# Altium schematic sheet Controller.SchDoc
size Legal
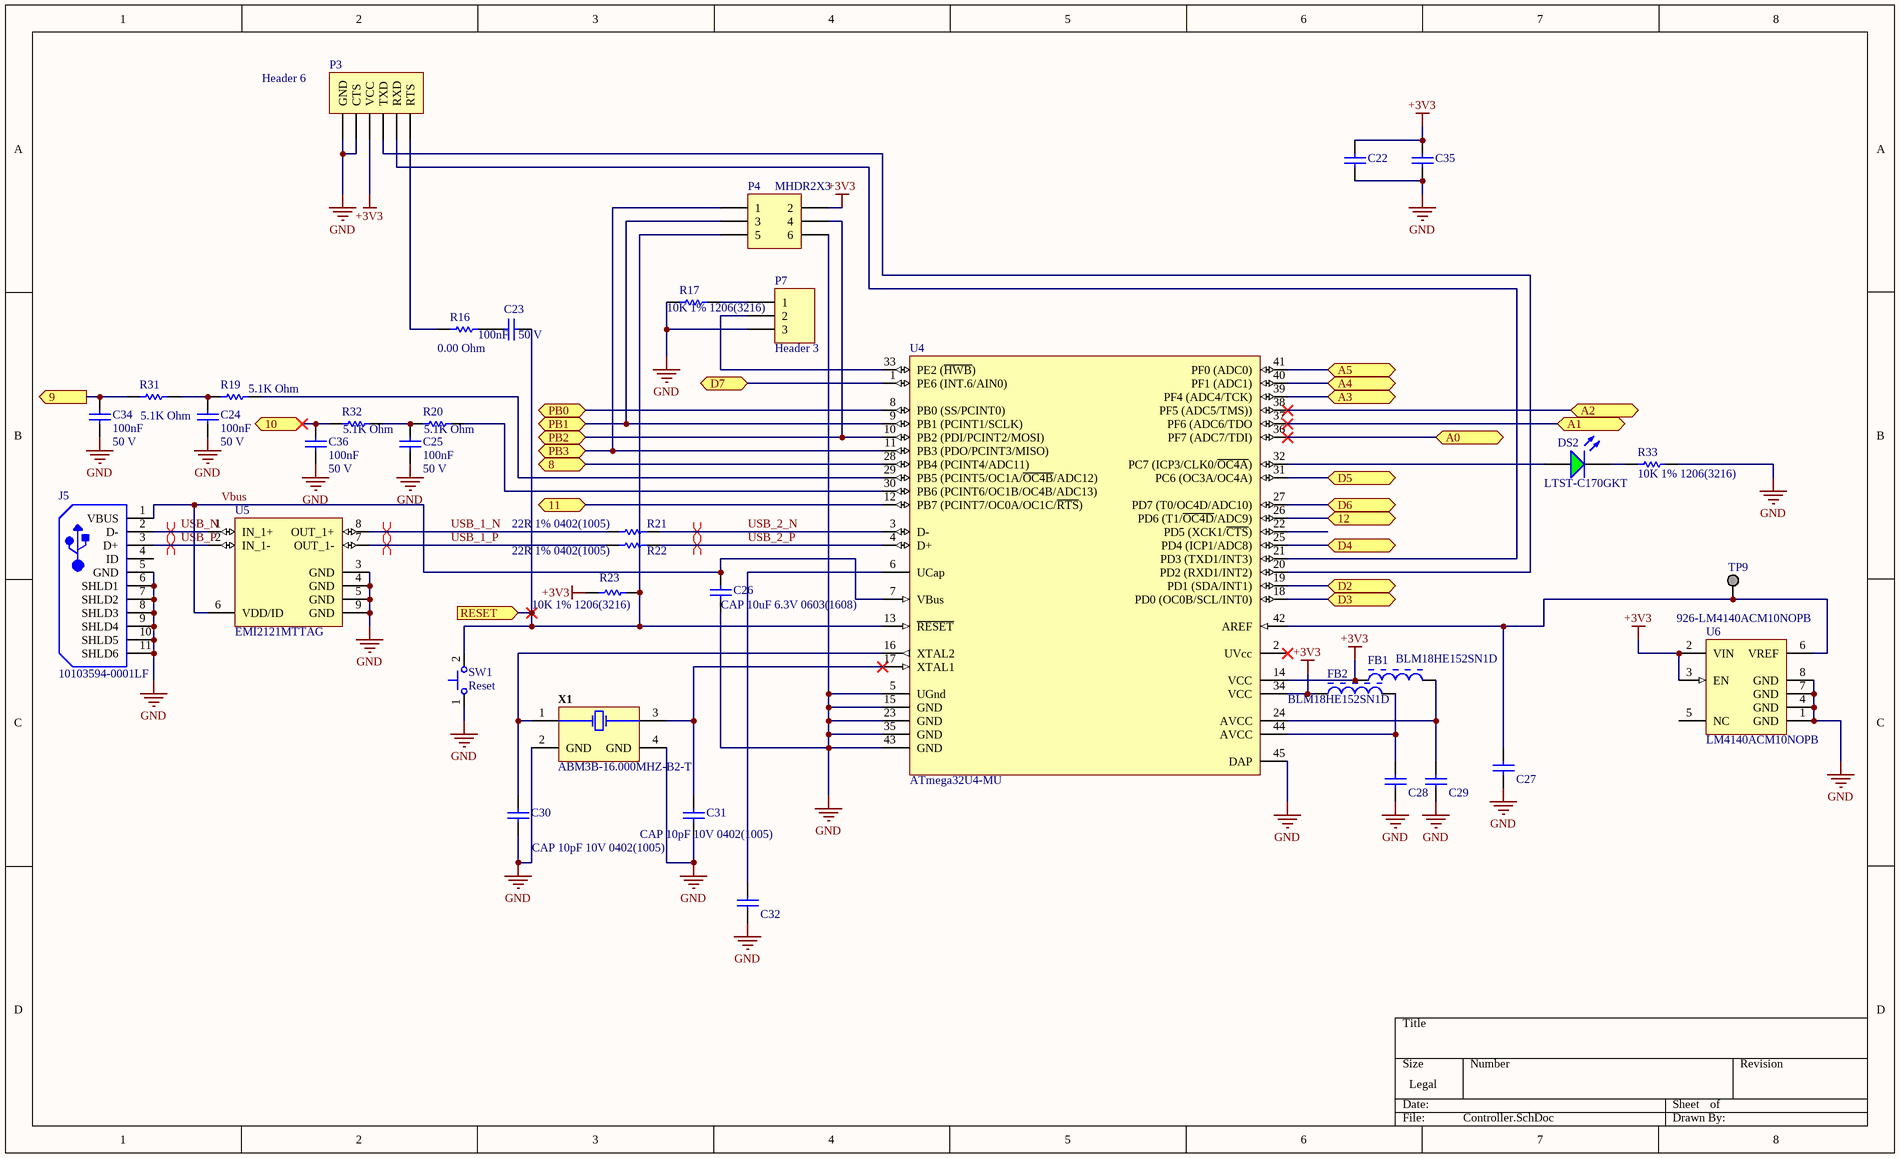
[diagram p0: Controller.SchDoc]

## Parts
C22  CAP 10uF 6.3V 0603(1608)  [CAPC0603(1608)100_L]  (value not drawn)
C23  value 100nF  Rated Voltage: 50 V  [CAPC1206(3216)100_N]  (hidden comment: CAP 100nF 50V 1206(3216))
C24  value 100nF  Rated Voltage: 50 V  [CAPC1206(3216)100_N]  (hidden comment: CAP 100nF 50V 1206(3216))
C25  value 100nF  Rated Voltage: 50 V  [CAPC1206(3216)100_N]  (hidden comment: CAP 100nF 50V 1206(3216))
C26  CAP 10uF 6.3V 0603(1608)  [CAPC0603(1608)100_L]
C27  CAP 1uF 25V 1206(3216)  [CAPC1206(3216)190_L]  (value not drawn)
C28  CAP 1uF 25V 1206(3216)  [CAPC1206(3216)190_L]  (value not drawn)
C29  CAP 1uF 25V 1206(3216)  [CAPC1206(3216)190_L]  (value not drawn)
C30  CAP 10pF 10V 0402(1005)  [CAPC0402(1005)60_L]
C31  CAP 10pF 10V 0402(1005)  [CAPC0402(1005)60_L]
C32  CAP 1uF 25V 1206(3216)  [CAPC1206(3216)190_L]  (value not drawn)
C34  value 100nF  Rated Voltage: 50 V  [CAPC1206(3216)100_N]  (hidden comment: CAP 100nF 50V 1206(3216))
C35  CAP 10uF 6.3V 0603(1608)  [CAPC0603(1608)100_L]  (value not drawn)
C36  value 100nF  Rated Voltage: 50 V  [CAPC1206(3216)100_N]  (hidden comment: CAP 100nF 50V 1206(3216))
DS2  LTST-C170GKT  [LTST-C170GKT_V]
FB1  BLM18HE152SN1D  [MURA-BLM18-RF-H4-CHIP-2_V]
FB2  BLM18HE152SN1D  [MURA-BLM18-RF-H4-CHIP-2_V]
J5  10103594-0001LF  [FCI-10103594-0001LF_V]
P3  Header 6  [HDR1X6]
P4  MHDR2X3  [MHDR2X3]
P7  Header 3  [HDR1X3]
R16  value 0.00 Ohm  [RESC1206(3216)_L]  (hidden comment: Jumper 1206(3216))
R17  10K 1% 1206(3216)  [RESC1206(3216)_L]
R19  value 5.1K Ohm  [RESC1206(3216)_L]  (hidden comment: 5K1 1% 1206(3216))
R20  value 5.1K Ohm  [RESC1206(3216)_L]  (hidden comment: 5K1 1% 1206(3216))
R21  22R 1% 0402(1005)  [RESC0402(1005)_L]
R22  22R 1% 0402(1005)  [RESC0402(1005)_L]
R23  10K 1% 1206(3216)  [RESC1206(3216)_L]
R31  value 5.1K Ohm  [RESC1206(3216)_L]  (hidden comment: 5K1 1% 1206(3216))
R32  value 5.1K Ohm  [RESC1206(3216)_L]  (hidden comment: 5K1 1% 1206(3216))
R33  10K 1% 1206(3216)  [RESC1206(3216)_L]
SW1  Reset  [JNFU-TVAF06_V]
TP9  ARef  [KSTN-1502-2]  (value not drawn)
U4  ATmega32U4-MU  [44PW_M]
U5  EMI2121MTTAG  [ONSC-WDFN-8-511BN_V]
U6  LM4140ACM10NOPB  Supplier Part Number 1: 926-LM4140ACM10NOPB  [D0008A_N]
X1  ABM3B-16.000MHZ-B2-T  [ABRA-ABM3B_V]

## Ports
8 (bidir), 9 (out), 10 (bidir), 11 (bidir), 12 (bidir), A0 (bidir), A1 (bidir), A2 (bidir), A3 (bidir), A4 (bidir), A5 (bidir), D2 (bidir), D3 (bidir), D4 (bidir), D5 (bidir), D6 (bidir), D7 (bidir), PB0 (bidir), PB1 (bidir), PB2 (bidir), PB3 (bidir), RESET (in)

## Nets
+3V3: C22.2 C35.2 FB1.1 FB2.1 P3.3(VCC) P4.2 R23.2 U4.14(VCC) U4.34(VCC) U6.2(VIN) U6.3(EN)
GND: C22.1 C24.2 C25.2 C26.1 C27.1 C28.1 C29.1 C30.1 C31.1 C32.1 C34.2 C35.1 C36.2 J5.5(GND) J5.6(SHLD1) J5.7(SHLD2) J5.8(SHLD3) J5.9(SHLD4) J5.10(SHLD5) J5.11(SHLD6) P3.1(GND) P3.2(CTS) P4.6 P7.3 R17.1 R33.2 SW1.1 U4.5(UGnd) U4.15(GND) U4.23(GND) U4.35(GND) U4.43(GND) U4.45(DAP) U5.3(GND) U5.4(GND) U5.5(GND) U5.9(GND) U6.1(GND) U6.4(GND) U6.7(GND) U6.8(GND) X1.2(GND) X1.4(GND)
8: U4.28(PB4_(PCINT4/ADC11)) ; port 8
9: C34.1 R31.1 ; port 9
10: C36.1 R32.1 ; port 10
11: U4.12(PB7_(PCINT7/OC0A/OC1C/~{RTS})) ; port 11
12: U4.26(PD6_(T1/~{OC4D}/ADC9)) ; port 12
A0: U4.36(PF7_(ADC7/TDI)) ; port A0
A1: U4.37(PF6_(ADC6/TDO) ; port A1
A2: U4.38(PF5_(ADC5/TMS))) ; port A2
A3: U4.39(PF4_(ADC4/TCK)) ; port A3
A4: U4.40(PF1_(ADC1)) ; port A4
A5: U4.41(PF0_(ADC0)) ; port A5
D2: U4.19(PD1_(SDA/INT1)) ; port D2
D3: U4.18(PD0_(OC0B/SCL/INT0)) ; port D3
D4: U4.25(PD4_(ICP1/ADC8)) ; port D4
D5: U4.31(PC6_(OC3A/OC4A)) ; port D5
D6: U4.27(PD7_(T0/OC4D/ADC10)) ; port D6
D7: U4.1(PE6_(INT.6/AIN0)) ; port D7
PB0: U4.8(PB0_(SS/PCINT0)) ; port PB0
PB1: P4.3 U4.9(PB1_(PCINT1/SCLK)) ; port PB1
PB2: P4.4 U4.10(PB2_(PDI/PCINT2/MOSI)) ; port PB2
PB3: P4.1 U4.11(PB3_(PDO/PCINT3/MISO)) ; port PB3
RESET: C23.2 P4.5 R23.1 SW1.2 U4.13(~{RESET}) ; port RESET
USB_1_N: R21.1 U5.8(OUT_1+)
USB_1_P: R22.1 U5.7(OUT_1-)
USB_2_N: R21.2 U4.3(D-)
USB_2_P: R22.2 U4.4(D+)
USB_N: J5.2(D-) U5.1(IN_1+)
USB_P: J5.3(D+) U5.2(IN_1-)
Vbus: C26.2 J5.1(VBUS) U4.7(VBus) U5.6(VDD/ID)
NetC23_1: C23.1 R16.2
NetC24_1: C24.1 R19.1 R31.2
NetC25_1: C25.1 R20.1 R32.2
NetC27_2: C27.2 TP9.1 U4.42(AREF) U6.6(VREF)
NetC28_2: C28.2 FB2.2 U4.44(AVCC)
NetC29_2: C29.2 FB1.2 U4.24(AVCC)
NetC30_2: C30.2 U4.16(XTAL2) X1.1(X1)
NetC31_2: C31.2 U4.17(XTAL1) X1.3(X2)
NetC32_2: C32.2 U4.6(UCap)
NetDS2_1: DS2.1(A) U4.32(PC7_(ICP3/CLK0/~{OC4A}))
NetDS2_2: DS2.2(K) R33.1
NetP3_4: P3.4(TXD) U4.20(PD2_(RXD1/INT2))
NetP3_5: P3.5(RXD) U4.21(PD3_(TXD1/INT3))
NetP3_6: P3.6(RTS) R16.1
NetP7_1: P7.1 R17.2
NetP7_2: P7.2 U4.33(PE2_(~{HWB}))
NetR19_2: R19.2 U4.29(PB5_(PCINT5/OC1A/~{OC4B}/ADC12))
NetR20_2: R20.2 U4.30(PB6_(PCINT6/OC1B/OC4B/ADC13))

Not connected (* = marked no-connect by the designer): J5 4(ID); U4 2(UVcc)* 22(PD5_(XCK1/~{CTS})); U6 5(NC)

## Layout directives
differential pair: USB_1_N, USB_1_P, USB_2_N, USB_2_P, USB_N, USB_P

## Library data of the parts
C22 C26 C35 = CMP-1035-02796-1: CAP 10uF 6.3V ±10% 0603 (1608 Metric) Thickness 1mm SMD; Case-EIA: 0603; Case-Metric: 1608; Tolerance: ±10%; Value: 10uF; Technology: SMT; Rated Voltage: 6.3 V; Max Thickness: 1 mm
C23-C25 C34 C36 = CMP-1037-04202-1: CAP 100nF 50V ±10% 1206 (3216 Metric) Thickness 1mm SMD; Case-Metric: 3216; Tolerance: Â±10%; Case-EIA: 1206; Technology: SMT; Max Thickness: 1 mm
C27-C29 C32 = CMP-1037-04699-1: CAP 1uF 25V ±5% 1206 (3216 Metric) Thickness 1.9mm SMD; Tolerance: Â±5%; Case-EIA: 1206; Case-Metric: 3216; Rated Voltage: 25 V; Max Thickness: 1.9 mm; Technology: SMT; Value: 1uF
C30 C31 = CMP-1034-00701-1: CAP 10pF 10V ±2% 0402 (1005 Metric) Thickness 0.6mm SMD; Case-Metric: 1005; Case-EIA: 0402; Rated Voltage: 10 V; Max Thickness: 0.6 mm; Tolerance: ±2%; Value: 10pF; Technology: SMT
DS2 = CMP-1674-00002-5: LED Uni-Color Green, 100 mW, 120 mA, -55 to 85 degC, 2-Pin SMD, RoHS, Tape and Reel; Manufacturer: Lite-On; ComponentLink1URL: http://www.us.liteon.com/; Height: 1.1 mm; PackageDescription: 2-Pin Surface Mount Device, Body 2 x 1.25 mm; RoHSCompliant: true; Package Quantity: 1; Packaging: Tape and Reel; Mount: Surface Mount; Min Operating Temperature: -55 degC; DatasheetVersion: 03/2003; Max Operating Temperature: 85 degC; ComponentLink1Description: Manufacturer URL; Pins: 2; Mounting Technology: Surface Mount; Length: 2 mm; Colour: Green; PackageReference: C170GKT; ComponentLink2URL: http://media.digikey.com/pdf/Data%20Sheets/Lite-On%20PDFs/LTST-C170GKT.pdf; ComponentLink2Description: Datasheet
FB1 FB2 = CMP-0686-00368-2: Chip Ferrite Bead for GHz Band High-speed Signal Lines, 1500 Ohm, 500 mA, -55 to 125 degC, 1.6 x 0.8 x 0.95 mm SMD, Tape and Reel; Manufacturer: Murata; Rated Current: 500 mA; Impedance (at 100 MHz): 1500 Ohm +/- 25%; DC Resistance: 0.50 Ohm Max.; Packing: Tape and Reel; DatasheetVersion: 08/2013; ComponentLink1URL: http://www.murata.com/; Mounting Technology: Surface Mount; ComponentLink2URL: http://www.murata.com/products/catalog/pdf/c31e.pdf; ComponentLink3Description: Package Specification; ComponentLink2Description: Datasheet; PackageReference: BLM18_H950-2; ComponentLink1Description: Manufacturer URL; PackageDescription: 2-Pin Chip, Body 1.6 x 0.8 mm; ComponentLink3URL: http://www.murata.com/products/catalog/pdf/c31e.pdf; PartNumber: BLM18HE152SN1D; Operating Temperature Range: -55 to 125 degC
J5 = CMP-1698-00007-1: Micro USB 2.0 B Receptacle, -55 to 85 degC, 5-Pin SMD, RoHS, Tape and Reel; Type (Resistor): Thick Film; Case\Package: 0603; Resistance: 4.7 kohm; Tolerance: 1%; Voltage Rating: 75 V; Power Rating: 100 mW; Case Code (Imperial): 0603; Case Code (Metric): 1608; REACH SVHC: Unknown; ComponentLink1URL: http://portal.fciconnect.com/; Package Quantity: 5000; RoHSCompliant: true; Max Operating Temperature: 155 degC; Min Operating Temperature: -55 degC; Mount: Surface Mount; Weight: 7.1E-05 oz; Length: 1.55 mm; PackageDescription: 5-Pin Surface Mount Device, Body 8.04 x 5.62 mm; Pins: 2; Height: 0.45 mm; ComponentLink2Description: Datasheet; ComponentLink2URL: http://portal.fciconnect.com/Comergent//fci/drawing/10103594.pdf; PackageReference: FCI-10103594-0001LF; DatasheetVersion: Rev. A, 06/2010; Width: 0.85 mm; Packaging: Tape and Reel; ComponentLink1Description: Manufacturer URL
P3 = Header 6: Header, 6-Pin; LatestRevisionDate: 17-Jul-2002; LatestRevisionNote: Re-released for DXP Platform.; Publisher: Altium Limited
P4 = MHDR2X3: Header, 3-Pin, Dual row; LatestRevisionDate: 17-Jul-2002; LatestRevisionNote: Re-released for DXP Platform.; Publisher: Altium Limited
P7 = Header 3: Header, 3-Pin; LatestRevisionDate: 17-Jul-2002; LatestRevisionNote: Re-released for DXP Platform.; Publisher: Altium Limited
R16 = CMP-1014-00001-1: Jumper 1206 (3216 Metric); Tolerance: None; Case-EIA: 1206; Case-Metric: 3216; Populate: 0; Technology: SMT; Power: None
R17 R23 R33 = CMP-1014-00623-1: 10K 0.25W 1% 1206 (3216 Metric)  SMD; Case-Metric: 3216; Value: 10000.00 Ohm; Case-EIA: 1206; Power: 0.25 W; Technology: SMT; Tolerance: 1 %
R19 R20 R31 R32 = CMP-1014-00590-1: 5K1 0.25W 1% 1206 (3216 Metric)  SMD; Case-EIA: 1206; Case-Metric: 3216; Power: 0.25 W; Technology: SMT; Tolerance: 1 %
R21 R22 = CMP-1011-00320-1: 22R 0.063W 1% 0402 (1005 Metric)  SMD; Case-EIA: 0402; Case-Metric: 1005; Value: 22.00 Ohm; Tolerance: 1 %; Technology: SMT; Power: 0.063 W
SW1 = CMP-0587-00001-2: Switch, SPST Push Button, 50 mA, 12 V DC, SMD, -30 to 85 degC, RoHS; Manufacturer: Jianfu; PartNumber: TVAF06; Contact Resistance: 100 mW max; Lifetime: 100000 Cycles min; Rating: 50 mA. 12 V DC; Insulation Resistance: 100 MW min. 100 V DC; Travel: 0.13 +/- 0.05 mm; Dielectric Strength: 250 V AC for 1 min; RoHS: TRUE; Mounting Technology: Surface Mount; PackageDescription: 2-Pin Switch, Push Button, SMD, Body 2.9 x 3.9 mm; ComponentLink1Description: Manufacturer URL; ComponentLink1URL: http://www.jian-fu.com/; Operating Temperature: -30 to 85 degC; ComponentLink2URL: http://en.jian-fu.com/product-22.html; PackageReference: TVAF06; ComponentLink2Description: Datasheet
TP9 = CMP-1672-00001-4: Terminal DBL Turret, Through Hole, RoHS; Contact Finish: Tin; Lead Pitch: 0.218 inch; PackageReference: 1502-2; Mount: Through Hole; Pins: 50; DatasheetVersion: Rev. A, 02/2008; RoHSCompliant: true; REACH SVHC: No SVHC; Contact Material: Brass; Length: 2.77 mm; PackageDescription: 1-Pin Through Hole Device, Dia 3.18 mm; Package Quantity: 1; Mounting Technology: Through Hole; Supplier 1: Mouser; Supplier Part Number 1: 575-2501200800000
U4 = CMP-0095-00166-2: 8-bit AVR Microcontroller, 2.7-5.5V, 16MHz, 32KB Flash, 1KB EEPROM, 2.5KB SRAM, USB Controller, 44-pin QFN, Industrial Grade (-40°C to 85°C), Ext Osc; PackageVersion: revG, Sep-2009; PackageReference: 44PW; ComponentLink1URL: http://www.atmel.com/; PackageDescription: 44-Pin Quad Flat No-Lead Package, 7 x 7 mm Body, 0.5 mm Pitch (QFN); ComponentLink3Description: ATmega16U4 ATmega32U4 Summary; RevisionNote: DatasheetVersion, PackageVersion & PCB updated. URLs added.; ComponentLink2Description: ATmega16U4/32U4 Datasheet; ComponentLink1Description: Manufacturer URL; ComponentLink3URL: http://www.atmel.com/dyn/resources/prod_documents/7766S.pdf; DatasheetVersion: revF, Nov-2010; ComponentLink2URL: http://www.atmel.com/dyn/resources/prod_documents/doc7766.pdf; Code_JEDEC: MO-220-VKKD-1
U5 = CMP-1066-00065-1: Single Pair Common Mode Filter with ESD Protection, -40 to 85 degC, 8-Pin WDFN, Pb-Free, Tape and Reel; Manufacturer: On Semiconductor; C Typ (pF): 0.8; Number of Lines: 3; VRWM Max (V): 5; ComponentLink2Description: Datasheet; PackageReference: WDFN-8-511BN; RoHS: Pb-Free; ComponentLink1Description: Manufacturer URL; PartNumber: EMI2121MTTAG; DatasheetVersion: Rev. 2; PackageVersion: Rev. A, 12/2012; PackageDescription: 8-Pin Small Outline No-Lead, Body 2.2 x 2 mm, Pitch 0.5 mm; Mounting Technology: Surface Mount; ComponentLink1URL: http://www.onsemi.com/; ComponentLink2URL: http://www.onsemi.com/pub_link/Collateral/EMI2121MT-D.PDF; Packing: Tape and Reel; ComponentLink3Description: Package Specification; ComponentLink3URL: http://www.onsemi.com/pub_link/Collateral/511BN.PDF
U6 = CMP-0074-00330-3: Precision Micropower Low Dropout Voltage Reference, 8-pin Narrow SOIC; Manufacturer: Texas Instruments; CompType: Voltage Reference IC; PowerWise: Y; PackageTopMarking: NSZXTT*4140A*CM2.0; ComponentLink1URL: http://www.ti.com/general/docs/lit/getliterature.tsp?genericPartNumber=LM4140&fileType=pdf; ComponentLink1Description: Datasheet; RevisionNote: Component URLs added; DatasheetVersion: Feb-2005; PinCount: 8; Code_JEDEC: MS-012-AA; RoHS: N; PackageDescription: SOIC Narrow, 4.9 x 3.9 x 1.45mm, 8 Lead, 1.27mm Pitch; Code_IPC: SOIC127P600-8; PackageReference: D0008A; PackageVersion: revM, May-2009; Supplier 1: Mouser
X1 = CMP-1688-00002-1: Ceramic SMD Crystal, 8 MHz, +/- 20 ppm, 200 Ohm, -20 to 70 degC, 4-Pin SMD, RoHS, Tape and Reel; Max Supply Voltage: 45 V; Outputs: 4; Min Supply Voltage: 8.2 V; Output Voltage: 3.3 V; Switching Frequency: 30 KHz; Output Current: 1.8 A; Packaging: Rail/Tube; ComponentLink2Description: Datasheet; REACH SVHC: No SVHC; ComponentLink1URL: http://www.abracon.com/; PackageReference: ABM3B; Weight: 0.004233 oz; Height: 1.05 mm; ComponentLink2URL: http://www.abracon.com/Resonators/abm3b.pdf; Mount: Surface Mount; Min Operating Temperature: -40 degC; Max Operating Temperature: 85 degC; Package Quantity: 50; PackageDescription: 4-Pin Surface Mount Device, Body 5 x 3.2 mm; Pins: 28; DatasheetVersion: Aug-15; ComponentLink1Description: Manufacturer URL; RoHSCompliant: true; Radiation Hardening: No; Length: 9.8 mm; Width: 4.5 mm